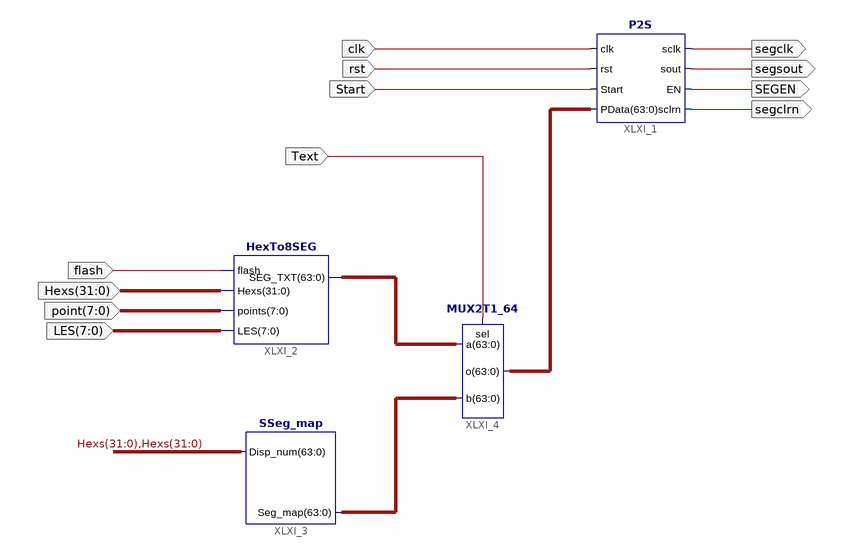
[diagram p0: schematic sheet 1]
// Xilinx ISE schematic Display.sch (kintex7) as structural Verilog: 4 symbols, 12 ports
module Display (
  input  Start,
  input  rst,
  input  clk,
  input  Text,
  input  flash,
  input  [31:0] Hexs,
  input  [7:0] point,
  input  [7:0] LES,
  output segclrn,
  output SEGEN,
  output segsout,
  output segclk
);

  wire [63:0] XLXN_4, XLXN_5, XLXN_6;

  P2S XLXI_1 (
    .sclrn(segclrn), .sout(segsout), .rst(rst), .EN(SEGEN), .Start(Start), .clk(clk), .sclk(segclk),
    .PData(XLXN_6));
  HexTo8SEG XLXI_2 (.LES(LES), .points(point), .Hexs(Hexs), .SEG_TXT(XLXN_4), .flash(flash));
  SSeg_map XLXI_3 (.Disp_num({Hexs, Hexs}), .Seg_map(XLXN_5));
  MUX2T1_64 XLXI_4 (.b(XLXN_5), .sel(Text), .a(XLXN_4), .o(XLXN_6));
endmodule
